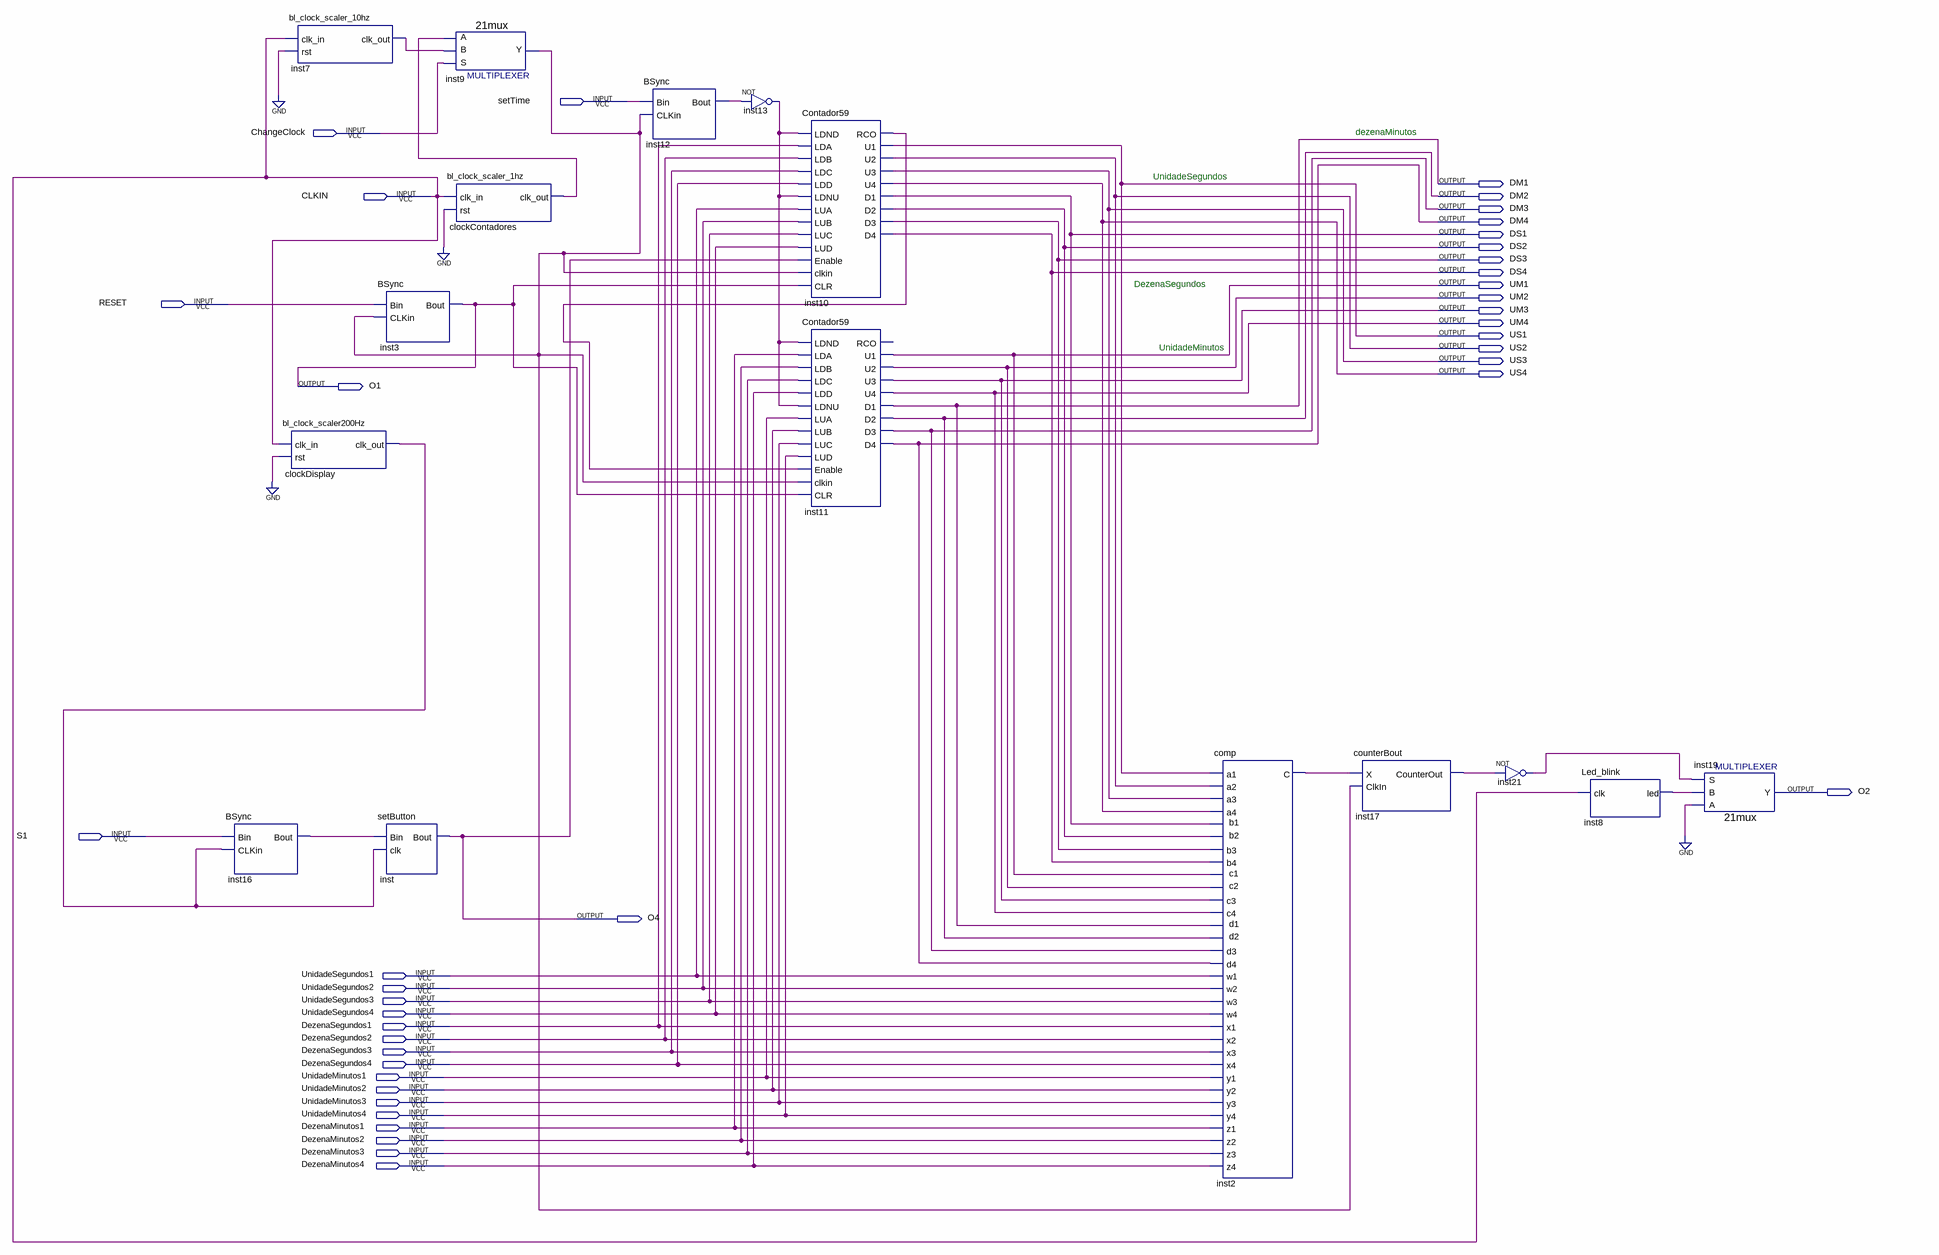
[diagram p0: schematic sheet]
// Quartus schematic Relogio.bdf as structural Verilog: 16 symbols, 40 pins
module Relogio (
  input  setTime,
  input  ChangeClock,
  input  CLKIN,
  input  RESET,
  input  S1,
  input  UnidadeSegundos1,
  input  UnidadeSegundos2,
  input  UnidadeSegundos3,
  input  UnidadeSegundos4,
  input  DezenaSegundos1,
  input  DezenaSegundos2,
  input  DezenaSegundos3,
  input  DezenaSegundos4,
  input  UnidadeMinutos1,
  input  UnidadeMinutos2,
  input  UnidadeMinutos3,
  input  UnidadeMinutos4,
  input  DezenaMinutos1,
  input  DezenaMinutos2,
  input  DezenaMinutos3,
  input  DezenaMinutos4,
  output DM1,
  output DM2,
  output DM3,
  output DM4,
  output DS1,
  output DS2,
  output DS3,
  output DS4,
  output UM1,
  output UM2,
  output UM3,
  output UM4,
  output US1,
  output US2,
  output US3,
  output US4,
  output O1,
  output O2,
  output O4
);

  wire clockContadores_clk_out, clockDisplay_clk_out, inst2_c, inst7_clk_out, inst8_led, inst9_y, inst10_rco,
       inst12_bout, inst13_out, inst16_bout, inst17_counterout, inst21_out;

  BSync inst16 (.Bin(S1), .CLKin(clockDisplay_clk_out), .Bout(inst16_bout));
  bl_clock_scaler_10hz inst7 (.clk_in(CLKIN), .rst(1'b0), .clk_out(inst7_clk_out));
  bl_clock_scaler200Hz clockDisplay (.clk_in(CLKIN), .rst(1'b0), .clk_out(clockDisplay_clk_out));
  BSync inst3 (.Bin(RESET), .CLKin(inst9_y), .Bout(O1));
  setButton inst (.Bin(inst16_bout), .clk(clockDisplay_clk_out), .Bout(O4));
  \21mux  inst9 (.S(ChangeClock), .B(inst7_clk_out), .A(clockContadores_clk_out), .Y(inst9_y));
  bl_clock_scaler_1hz clockContadores (.clk_in(CLKIN), .rst(1'b0), .clk_out(clockContadores_clk_out));
  BSync inst12 (.Bin(setTime), .CLKin(inst9_y), .Bout(inst12_bout));
  not inst13 (inst13_out, inst12_bout);
  Contador59 inst10 (
    .LDND(inst13_out), .LDA(DezenaSegundos1), .LDB(DezenaSegundos2), .LDC(DezenaSegundos3),
    .LDD(DezenaSegundos4), .LDNU(inst13_out), .LUA(UnidadeSegundos1), .LUB(UnidadeSegundos2),
    .LUC(UnidadeSegundos3), .LUD(UnidadeSegundos4), .Enable(O4), .clkin(inst9_y), .CLR(O1), .RCO(inst10_rco),
    .U1(US1), .U2(US2), .U3(US3), .U4(US4), .D1(DS1), .D2(DS2), .D3(DS3), .D4(DS4));
  Contador59 inst11 (
    .LDND(inst13_out), .LDA(DezenaMinutos1), .LDB(DezenaMinutos2), .LDC(DezenaMinutos3),
    .LDD(DezenaMinutos4), .LDNU(inst13_out), .LUA(UnidadeMinutos1), .LUB(UnidadeMinutos2),
    .LUC(UnidadeMinutos3), .LUD(UnidadeMinutos4), .Enable(inst10_rco), .clkin(inst9_y), .CLR(O1), .U1(UM1),
    .U2(UM2), .U3(UM3), .U4(UM4), .D1(DM1), .D2(DM2), .D3(DM3), .D4(DM4));  // open: RCO
  comp inst2 (
    .a1(US1), .b1(DS1), .c1(UM1), .d1(DM1), .a2(US2), .b2(DS2), .c2(UM2), .d2(DM2), .a3(US3), .b3(DS3),
    .c3(UM3), .d3(DM3), .a4(US4), .b4(DS4), .c4(UM4), .d4(DM4), .w1(UnidadeSegundos1), .w2(UnidadeSegundos2),
    .w3(UnidadeSegundos3), .w4(UnidadeSegundos4), .x1(DezenaSegundos1), .x2(DezenaSegundos2),
    .x3(DezenaSegundos3), .x4(DezenaSegundos4), .y1(UnidadeMinutos1), .y2(UnidadeMinutos2),
    .y3(UnidadeMinutos3), .y4(UnidadeMinutos4), .z1(DezenaMinutos1), .z2(DezenaMinutos2),
    .z3(DezenaMinutos3), .z4(DezenaMinutos4), .C(inst2_c));
  counterBout inst17 (.X(inst2_c), .ClkIn(inst9_y), .CounterOut(inst17_counterout));
  not inst21 (inst21_out, inst17_counterout);
  Led_blink inst8 (.clk(CLKIN), .led(inst8_led));
  \21mux  inst19 (.S(inst21_out), .B(inst8_led), .A(1'b0), .Y(O2));

  // Notes on the sheet:
  //   dezenaMinutos
  //   UnidadeSegundos
  //   DezenaSegundos
  //   UnidadeMinutos
endmodule
